# EAGLE design TPS62173 Breakout (EAGLE 9.5.2)
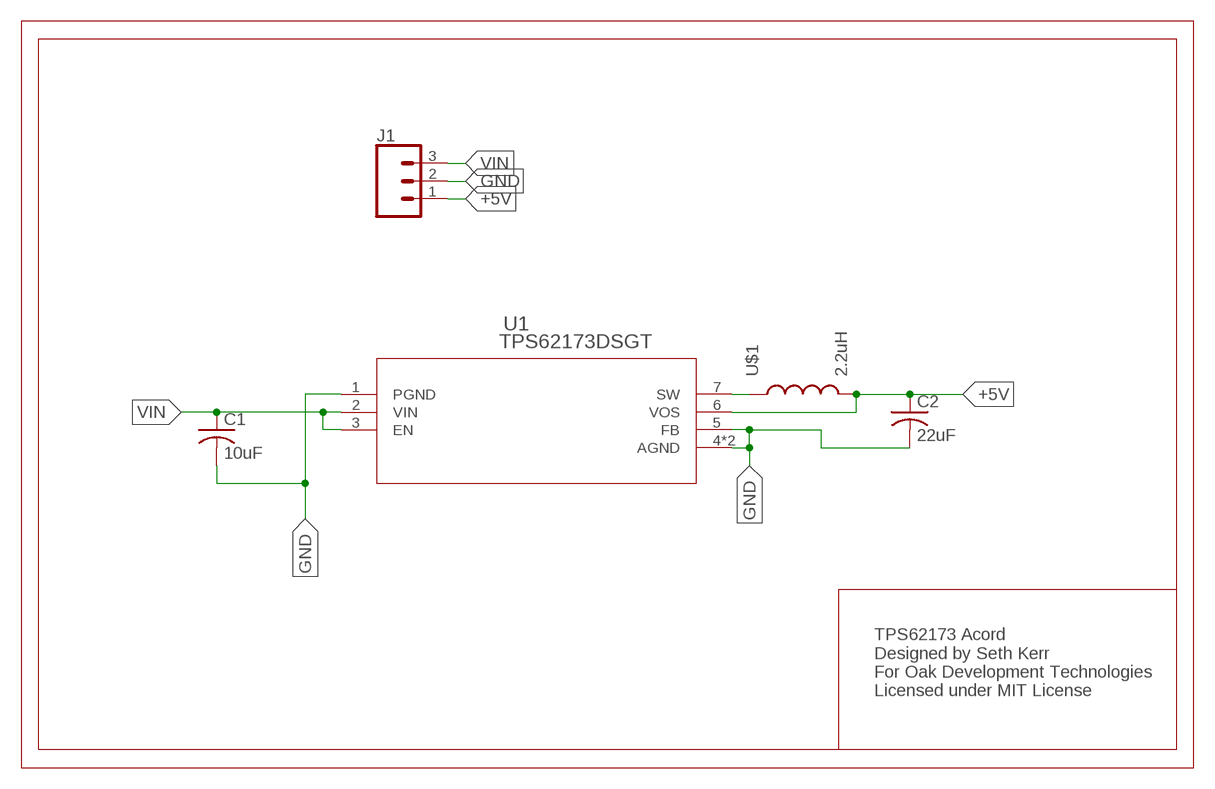
[diagram p0: schematic, sheet 1]

## Parts
C1  10uF  C-USC0603  [C0603]
C2  22uF  C-USC0603  [C0603]
J1  CONN_031X03_NO_SILK  [1X03_NO_SILK]
U1  TPS62173DSGT  [DSG8_1P6X0P9_TEX]
U$1  2.2uH  NR3015T2R2M  [2.7X3MM]

## Nets
+5V: C2.1 J1.1 U1.6(VOS) U$1.2
GND: C1.2 C2.2 J1.2 U1.1(PGND) U1.4(AGND) U1.5(FB) U1.9(AGND)
N$2: U1.7(SW) U$1.1
VIN: C1.1 J1.3 U1.2(VIN) U1.3(EN)

## Notes on the sheet
- TPS62173 Acord
  Designed by Seth Kerr
  For Oak Development Technologies
  Licensed under MIT License

## Library data of the parts
C1 C2 = rcl:C-US: CAPACITOR, American symbol; SPICEPREFIX: C
J1 = SparkFun-Connectors:CONN_03: Multi connection point. Often used as Generic Header-pin footprint for 0.1 inch spaced/style header connections On any of the 0.1 inch spaced packages, you can populate with these: Break Away Headers - Straight <https://www.sparkfun.com/products/116> (PRT-00116) Break Away Male Headers - Right Angle <https://www.sparkfun.com/products/553> (PRT-00553) Female Headers <https://www.sparkfun.com/products/115> (PRT-00115) Break Away Headers - Machine Pin <https://www.sparkfun.com/products/117> (PRT-00117) Break Away Female Headers - Swiss Machine Pin <https://www.sparkfun.com/products/743> (PRT-00743) Stackable Header - 3 Pin (Female, 0.1") <https://www.sparkfun.com/products/13875> (PRT-13875) For SCREWTERMINALS and SPRING TERMINALS visit here: Screw Terimnals on SparkFun.com <https://www.sparkfun.com/search/results?term=Screw+Terminals> (5mm/3.5mm/2.54mm spacing) This device is also useful as a general connection point to wire up your design to another part of your project. Our various solder wires solder well into these plated through hole pads. Hook-Up Wire - Assortment (Stranded, 22 AWG) <https://www.sparkfun.com/products/11375> (PRT-11375) Hook-Up Wire - Assortment (Solid Core, 22 AWG) <https://www.sparkfun.com/products/11367> (PRT-11367) View the entire wire category on our website here <https://www.sparkfun.com/categories/141> Special notes: Molex polarized connector foot print use with SKU : PRT-08232 with associated crimp pins and housings.
U1 = TPS62173DSGT:TPS62173DSGT; BUILT_BY: EMA_UL_Team; MANUFACTURER: Texas Instruments; MANUFACTURER_PART_NUMBER: TPS62173DSGT; SOURCELIBRARY: TI_2014-06-19; VENDOR: Texas Instruments
U$1 = NR Inductors:NR3015T2R2M

## Board
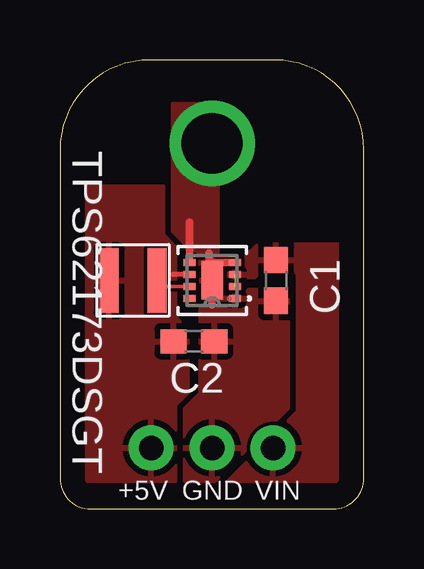
[diagram p1: board, top side]
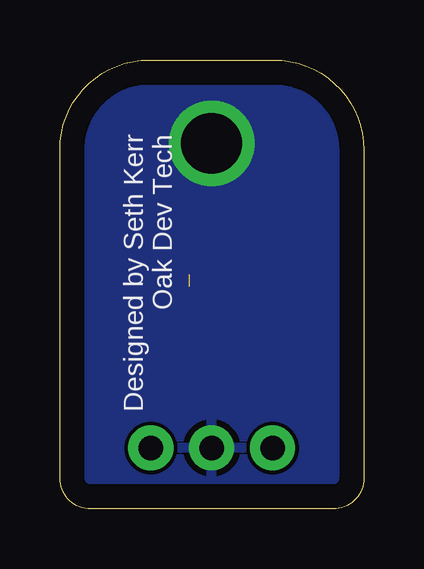
[diagram p2: board, bottom side, seen from below]

Size 12.68 x 18.72 mm. Coordinates in mm from the lower left corner, seen from the top.
Outline: 0,14.96 0,1.27 arc90 1.27,0 11.41,0 arc90 12.68,1.27 12.68,15 arc90 8.96,18.72 3.75,18.72 arc90 0,14.96
Copper layers (1*16): Top 0.035mm / dielectric 1.5mm / Bottom 0.035mm
Design rules "default": minimum track width 6mil, minimum drill 0.35mm, track to track 6mil, track to pad 6mil, pad to pad 6mil, via to via 6mil, smd to smd 6mil, copper to edge 40mil, drill to drill 6mil, minimum pad ring 10mil, minimum via ring 8mil, stop-mask expansion 4mil, vias tented up to drill 0mil, thermal gap 10mil

### Footprints (pad centres in the part's own frame; a part is rotated, then mirrored left to right if it is on the bottom)
C0603 = smd 1.1 x 1: 1 -0.85,0; 2 0.85,0
1X03_NO_SILK = drill 1.016 pad 1.88: 1 0,0; 2 2.54,0; 3 5.08,0
DSG8_1P6X0P9_TEX = smd 0.5 x 0.28: 1 -0.95,0.75; 2 -0.95,0.25; 3 -0.95,-0.25; 4 -0.95,-0.75; 5 0.95,-0.75; 6 0.95,-0.25; 7 0.95,0.25; 8 0.95,0.75 | smd 0.9 x 1.6: 9 0,0
2.7X3MM = smd 0.8 x 2.7: 1 -1,0; 2 1,0

### Placement (x,y rotation side)
C1  9.02,9.53 270 top
C2  5.59,6.99 0 top
J1  3.81,2.54 0 top
U1  6.35,9.53 180 top
U$1  3.05,9.53 180 top

### Tracks (layer width: path | path; a pad name or v marks a point on that pad's centre or on a via)
+5V
  Top 0.203: U1.6 4.71,9.78 4.7,9.78
  pour Top: 4.83,1.14 4.83,4.32 5.33,4.83 5.33,7.49 4.83,8 4.83,10.92 4.32,11.43 4.32,13.46 0.38,13.46 0.38,1.27 0.51,1.14
GND  (via drill 2.54)
  Top 0.305: 5.4,11.96 U1.5 | 6.24,10.28 6.24,9.64 U1.9 6.35,8.51 | 6.22,10.67 6.22,10.29 6.24,10.28 | U1.4 6.24,10.28
  other vias: 6.35,15.24
  pour Top: 4.7,16.89 4.7,11.56 5.84,10.41 5.84,4.83 5.21,4.19 5.21,1.14 6.48,1.14 9.53,4.19 9.53,9.14 7.87,9.14 7.62,8.89 6.6,8.89 6.6,16.89
  pour Bottom: -2.54,20.32 15.24,20.32 15.24,-1.27 -2.54,-1.27
N$2
  Top 0.152: U1.7 4.42,9.27 | 4.06,9.27 4.42,9.27 | 4.42,9.27
  Top 0.203: U$1.1 4.06,9.51 4.06,9.27
VIN  (1 unrouted)
  pour Top: 6.99,9.65 6.99,9.91 7.75,9.91 7.75,10.54 8.26,11.05 11.94,11.05 11.94,1.27 11.81,1.14 6.99,1.14 9.91,4.06 9.91,9.78 9.78,9.91 8.38,9.91 8.13,9.65

### Text on the board
tNames: +5V | GND | VIN
bNames: Designed by Seth Kerr / Oak Dev Tech